# Altium schematic sheet DACs.SCHDOC
size B
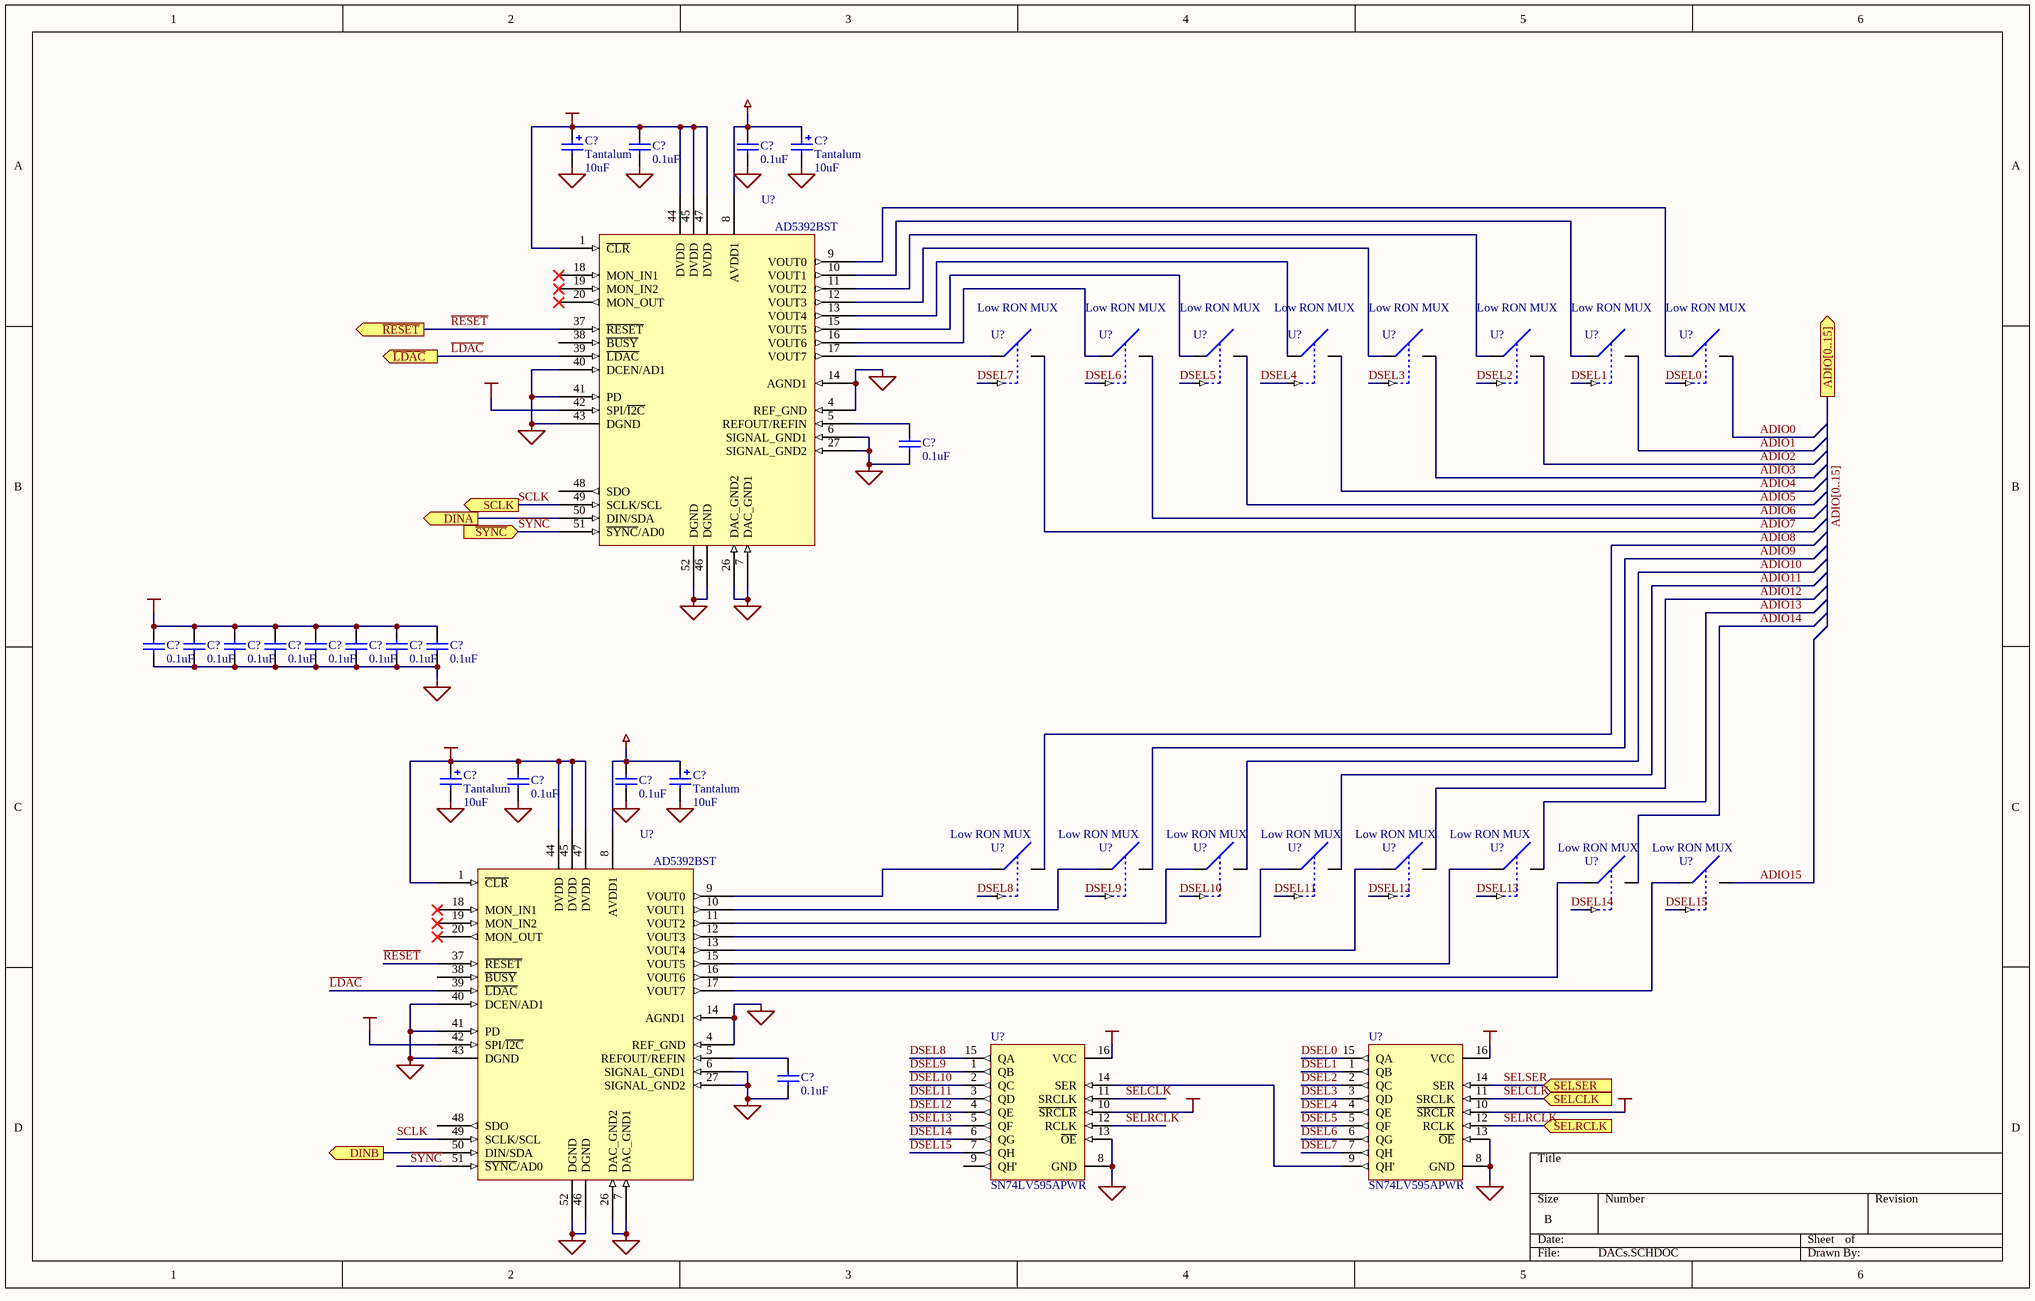
[diagram p0: DACs.SCHDOC]

## Parts
(Parts that share a designator on the sheet are numbered #1, #2 ... from top to bottom, then left to right.)
C?#1  Tantalum  value 10uF  [TC3528-1411]
C?#2  Tantalum  value 10uF  [TC3528-1411]
C?#3  value 0.1uF  [CC1608-0603]  (hidden comment: Cap)
C?#4  value 0.1uF  [CC1608-0603]  (hidden comment: Cap)
C?#5  value 0.1uF  [CC1608-0603]  (hidden comment: Cap)
C?#6  value 0.1uF  [CC1608-0603]  (hidden comment: Cap)
C?#7  value 0.1uF  [CC1608-0603]  (hidden comment: Cap)
C?#8  value 0.1uF  [CC1608-0603]  (hidden comment: Cap)
C?#9  value 0.1uF  [CC1608-0603]  (hidden comment: Cap)
C?#10  value 0.1uF  [CC1608-0603]  (hidden comment: Cap)
C?#11  value 0.1uF  [CC1608-0603]  (hidden comment: Cap)
C?#12  value 0.1uF  [CC1608-0603]  (hidden comment: Cap)
C?#13  value 0.1uF  [CC1608-0603]  (hidden comment: Cap)
C?#14  Tantalum  value 10uF  [TC3528-1411]
C?#15  Tantalum  value 10uF  [TC3528-1411]
C?#16  value 0.1uF  [CC1608-0603]  (hidden comment: Cap)
C?#17  value 0.1uF  [CC1608-0603]  (hidden comment: Cap)
C?#18  value 0.1uF  [CC1608-0603]  (hidden comment: Cap)
U?#1  Low RON MUX  [AD RM-8]
U?#2  Low RON MUX  [AD RM-8]
U?#3  Low RON MUX  [AD RM-8]
U?#4  Low RON MUX  [AD RM-8]
U?#5  Low RON MUX  [AD RM-8]
U?#6  Low RON MUX  [AD RM-8]
U?#7  Low RON MUX  [AD RM-8]
U?#8  Low RON MUX  [AD RM-8]
U?#9  AD5392BST  [QFP10x10-G52/Y1.6N]
U?#10  Low RON MUX  [AD RM-8]
U?#11  Low RON MUX  [AD RM-8]
U?#12  Low RON MUX  [AD RM-8]
U?#13  Low RON MUX  [AD RM-8]
U?#14  Low RON MUX  [AD RM-8]
U?#15  Low RON MUX  [AD RM-8]
U?#16  Low RON MUX  [AD RM-8]
U?#17  Low RON MUX  [AD RM-8]
U?#18  AD5392BST  [QFP10x10-G52/Y1.6N]
U?#19  SN74LV595APWR  [SSO-G16/X.4]
U?#20  SN74LV595APWR  [SSO-G16/X.4]

## Ports
ADIO[0..15] (out), DINA (out), DINB (out), SCLK (out), SELCLK (in), SELRCLK (in), SELSER (in), ~{LDAC} (out), ~{RESET} (out), ~{SYNC} (in)

## Nets
+5VCC: C?#6.2 C?#7.2 C?#8.2 C?#9.2 C?#10.2 C?#11.2 C?#12.2 C?#13.2 U?#19.10(~{SRCLR}) U?#19.16(VCC) U?#20.10(~{SRCLR}) U?#20.16(VCC)
AVDD: C?#2.1 C?#4.2 C?#15.1 C?#17.2 U?#9.8(AVDD1) U?#18.8(AVDD1)
GND: C?#1.2 C?#2.2 C?#3.1 C?#4.1 C?#5.1 C?#6.1 C?#7.1 C?#8.1 C?#9.1 C?#10.1 C?#11.1 C?#12.1 C?#13.1 C?#14.2 C?#15.2 C?#16.1 C?#17.1 C?#18.1 U?#1.7(GND) U?#2.7(GND) U?#3.7(GND) U?#4.7(GND) U?#5.7(GND) U?#6.7(GND) U?#7.7(GND) U?#8.7(GND) U?#9.4(REF_GND) U?#9.6(SIGNAL_GND1) U?#9.7(DAC_GND1) U?#9.14(AGND1) U?#9.26(DAC_GND2) U?#9.27(SIGNAL_GND2) U?#9.40(DCEN/AD1) U?#9.41(PD) U?#9.43(DGND) U?#9.46(DGND) U?#9.52(DGND) U?#10.7(GND) U?#11.7(GND) U?#12.7(GND) U?#13.7(GND) U?#14.7(GND) U?#15.7(GND) U?#16.7(GND) U?#17.7(GND) U?#18.4(REF_GND) U?#18.6(SIGNAL_GND1) U?#18.7(DAC_GND1) U?#18.14(AGND1) U?#18.26(DAC_GND2) U?#18.27(SIGNAL_GND2) U?#18.40(DCEN/AD1) U?#18.41(PD) U?#18.43(DGND) U?#18.46(DGND) U?#18.52(DGND) U?#19.8(GND) U?#19.13(~{OE}) U?#20.8(GND) U?#20.13(~{OE})
VCC: C?#1.1 C?#3.2 C?#14.1 C?#16.2 U?#9.1(~{CLR}) U?#9.42(SPI/~{I2C}) U?#9.44(DVDD) U?#9.45(DVDD) U?#9.47(DVDD) U?#18.1(~{CLR}) U?#18.42(SPI/~{I2C}) U?#18.44(DVDD) U?#18.45(DVDD) U?#18.47(DVDD)
VDD: U?#1.4(VDD) U?#2.4(VDD) U?#3.4(VDD) U?#4.4(VDD) U?#5.4(VDD) U?#6.4(VDD) U?#7.4(VDD) U?#8.4(VDD) U?#10.4(VDD) U?#11.4(VDD) U?#12.4(VDD) U?#13.4(VDD) U?#14.4(VDD) U?#15.4(VDD) U?#16.4(VDD) U?#17.4(VDD)
ADIO0: U?#8.8(S)
ADIO1: U?#7.8(S)
ADIO2: U?#6.8(S)
ADIO3: U?#5.8(S)
ADIO4: U?#4.8(S)
ADIO5: U?#3.8(S)
ADIO6: U?#2.8(S)
ADIO7: U?#1.8(S)
ADIO8: U?#10.8(S)
ADIO9: U?#11.8(S)
ADIO10: U?#12.8(S)
ADIO11: U?#13.8(S)
ADIO12: U?#14.8(S)
ADIO13: U?#15.8(S)
ADIO14: U?#16.8(S)
ADIO15: U?#17.8(S)
DINA: U?#9.50(DIN/SDA) ; port DINA
DINB: U?#18.50(DIN/SDA) ; port DINB
DSEL0: U?#8.6(IN) U?#20.15(QA)
DSEL1: U?#7.6(IN) U?#20.1(QB)
DSEL2: U?#6.6(IN) U?#20.2(QC)
DSEL3: U?#5.6(IN) U?#20.3(QD)
DSEL4: U?#4.6(IN) U?#20.4(QE)
DSEL5: U?#3.6(IN) U?#20.5(QF)
DSEL6: U?#2.6(IN) U?#20.6(QG)
DSEL7: U?#1.6(IN) U?#20.7(QH)
DSEL8: U?#10.6(IN) U?#19.15(QA)
DSEL9: U?#11.6(IN) U?#19.1(QB)
DSEL10: U?#12.6(IN) U?#19.2(QC)
DSEL11: U?#13.6(IN) U?#19.3(QD)
DSEL12: U?#14.6(IN) U?#19.4(QE)
DSEL13: U?#15.6(IN) U?#19.5(QF)
DSEL14: U?#16.6(IN) U?#19.6(QG)
DSEL15: U?#17.6(IN) U?#19.7(QH)
~{LDAC}: U?#9.39(~{LDAC}) U?#18.39(~{LDAC}) ; port ~{LDAC}
~{RESET}: U?#9.37(~{RESET}) U?#18.37(~{RESET}) ; port ~{RESET}
~{SYNC}: U?#9.51(~{SYNC}/AD0) U?#18.51(~{SYNC}/AD0) ; port ~{SYNC}
SCLK: U?#9.49(SCLK/SCL) U?#18.49(SCLK/SCL) ; port SCLK
SELCLK: U?#19.11(SRCLK) U?#20.11(SRCLK) ; port SELCLK
SELRCLK: U?#19.12(RCLK) U?#20.12(RCLK) ; port SELRCLK
SELSER: U?#20.14(SER) ; port SELSER
NetC?#5_2: C?#5.2 U?#9.5(REFOUT/REFIN)
NetC?#18_2: C?#18.2 U?#18.5(REFOUT/REFIN)
NetU?#1_1: U?#1.1(D) U?#9.17(VOUT7)
NetU?#2_1: U?#2.1(D) U?#9.16(VOUT6)
NetU?#3_1: U?#3.1(D) U?#9.15(VOUT5)
NetU?#4_1: U?#4.1(D) U?#9.13(VOUT4)
NetU?#5_1: U?#5.1(D) U?#9.12(VOUT3)
NetU?#6_1: U?#6.1(D) U?#9.11(VOUT2)
NetU?#7_1: U?#7.1(D) U?#9.10(VOUT1)
NetU?#8_1: U?#8.1(D) U?#9.9(VOUT0)
NetU?#10_1: U?#10.1(D) U?#18.9(VOUT0)
NetU?#11_1: U?#11.1(D) U?#18.10(VOUT1)
NetU?#12_1: U?#12.1(D) U?#18.11(VOUT2)
NetU?#13_1: U?#13.1(D) U?#18.12(VOUT3)
NetU?#14_1: U?#14.1(D) U?#18.13(VOUT4)
NetU?#15_1: U?#15.1(D) U?#18.15(VOUT5)
NetU?#16_1: U?#16.1(D) U?#18.16(VOUT6)
NetU?#17_1: U?#17.1(D) U?#18.17(VOUT7)
NetU?#19_14: U?#19.14(SER) U?#20.9(QH')

Not connected (* = marked no-connect by the designer): U?#9 18(MON_IN1)* 19(MON_IN2)* 20(MON_OUT)* 38(~{BUSY}) 48(SDO); U?#18 18(MON_IN1)* 19(MON_IN2)* 20(MON_OUT)* 38(~{BUSY}) 48(SDO); U?#19 9(QH')

## Buses and harness runs
bus ADIO[0..15] = port ADIO[0..15]

## Library data of the parts
C?#1 C?#2 C?#14 C?#15 = Cap Pol1: Polarized Capacitor (Radial); Manufacturer: Generic Components; Class I: Passive; Published: 8-Jun-2000; Revision: July-2002: Re-released for DXP Platform.; Publisher: Altium Limited; Class II: Capacitor
C?#3-C?#13 C?#16-C?#18 = Cap: Capacitor; Manufacturer: Generic Components; Class I: Passive; Published: 8-Jun-2000; Revision: July-2002: Re-released for DXP Platform.; Publisher: Altium Limited; Class II: Capacitor
U?#1-U?#8 U?#10-U?#17 = ADG802: Low Ron single-supply SPST NO mux.
U?#9 U?#18 = AD5392BST: 8-chan 14-BIT DAC
U?#19 U?#20 = SN74LV595APWR: 8-bit shift register with 3-state output